# EAGLE design v20 (EAGLE 9.6.1)
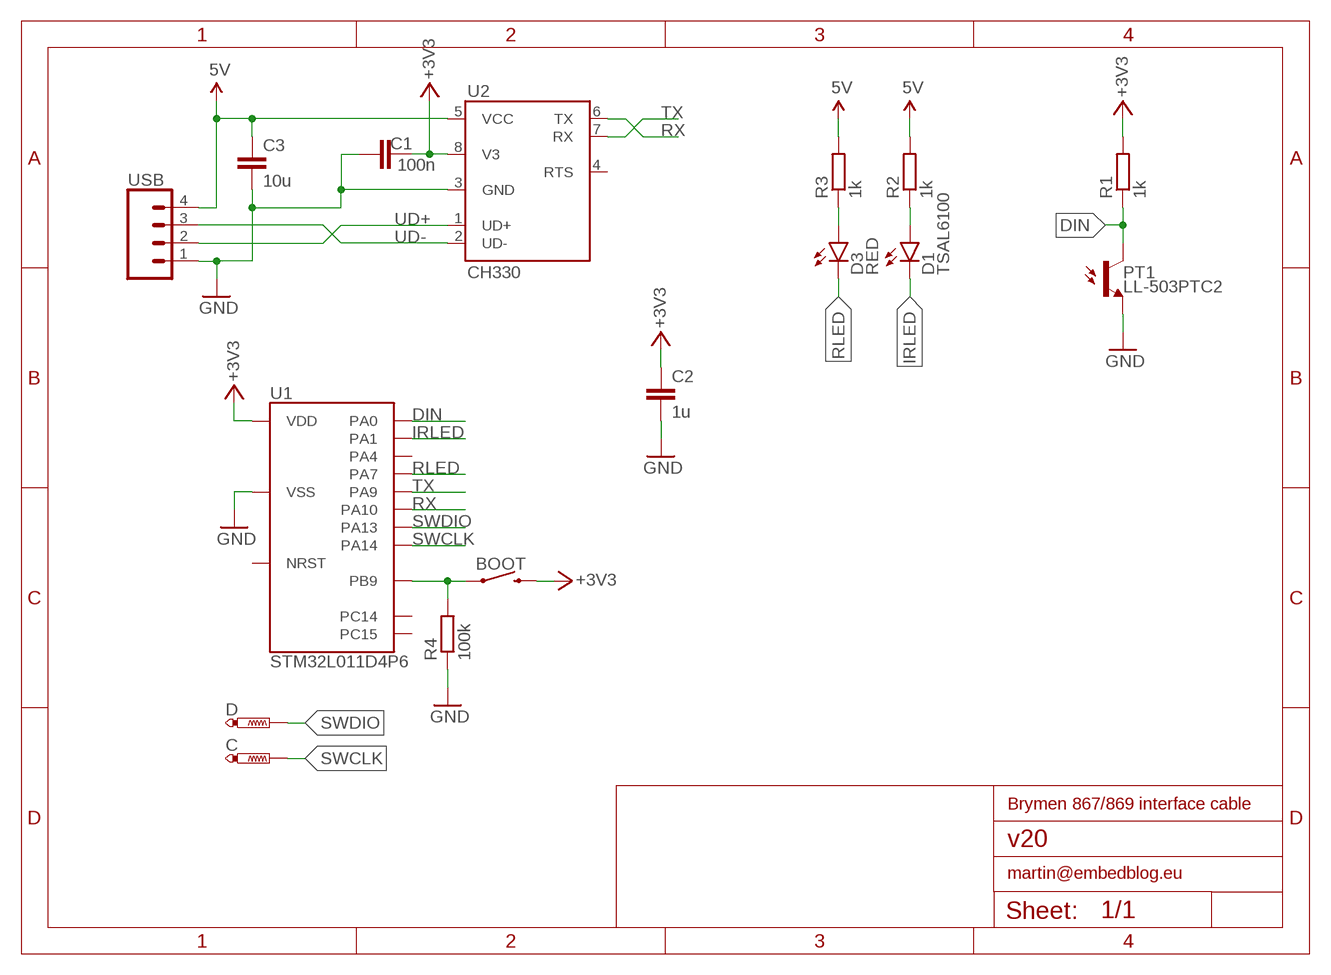
[diagram p0: schematic, sheet 1]

## Parts
BOOT  MOMENTARY-SWITCH-SPST-SMD-5.2MM  [TACTILE_SWITCH_SMD_5.2MM]
C  PTR1B1,27  [B1,27]
C1  100n  C-EUC0805  [C0805]
C2  1u  C-EUC0805  [C0805]
C3  10u  C-EUC0805  [C0805]
D  PTR1B1,27  [B1,27]
D1  TSAL6100  LED5MM  [LED5MM]
D3  RED  LED1206  [LED-1206]
PT1  LL-503PTC2  LL-503_PHOTOTRANSISTOR  [LED5MM]
R1  1k  R-EU_R0805  [R0805]
R2  1k  R-EU_R0805  [R0805]
R3  1k  R-EU_R0805  [R0805]
R4  100k  R-EU_R0805  [R0805]
U1  STM32L011D4P6  [TSSOP14]
U2  CH330  [SO08]
USB  CONN_04  [1X04]

## Nets
5V: C3.1 R2.2 R3.2 U2.5(VCC) USB.4
+3V3: BOOT.3 C1.2 C2.1 R1.2 U1.10(VDD) U2.8(V3)
DIN: PT1.K(C) R1.1 U1.5(PA0)
GND: C1.1 C2.2 C3.2 PT1.A(E) R4.1 U1.9(VSS) U2.3(GND) USB.1
IRLED: D1.K(C) U1.6(PA1)
N$1: BOOT.1 R4.2 U1.1(PB9)
N$3: D1.A R2.1
N$5: D3.A R3.1
RLED: D3.C U1.8(PA7)
RX: U1.12(PA10) U2.6(TX)
SWCLK: C.TP U1.14(PA14)
SWDIO: D.TP U1.13(PA13)
TX: U1.11(PA9) U2.7(RX)
UD+: U2.1(UD+) USB.2
UD-: U2.2(UD-) USB.3
Unconnected: U1.2(PC14) U1.3(PC15) U1.4(NRST) U1.7(PA4) U2.4(RTS)

## Notes on the sheet
- Brymen 867/869 interface cable
- martin@embedblog.eu

## Library data of the parts
BOOT = SparkFun-Switches:MOMENTARY-SWITCH-SPST: Momentary Switch (Pushbutton) - SPST Normally-open (NO) SPST momentary switches (buttons, pushbuttons). Variants PTH-12MM - 12mm square, through-hole Momentary Pushbutton Switch - 12mm Square <https://www.sparkfun.com/products/9190> (COM-09190) PTH-6.0MM, PTH-6.0MM-KIT - 6.0mm square, through-hole Mini Pushbutton Switch <https://www.sparkfun.com/products/97> (COM-00097) KIT package intended for soldering kit's - only one side of pads' copper is exposed. PTH-RIGHT-ANGLE-KIT - Right-angle, through-hole Right Angle Tactile Button <https://www.sparkfun.com/products/10791> - Used on SparkFun BigTime Watch Kit <https://www.sparkfun.com/products/11734> SMD-12MM - 12mm square, surface-mount Tactile Button - SMD (12mm) <https://www.sparkfun.com/products/12993> (COM-12993) Used on SparkFun PicoBoard <https://www.sparkfun.com/products/11888> SMD-4.5MM - 4.5mm Square Trackball Switch Used on SparkFun Blackberry Trackballer Breakout <https://www.sparkfun.com/products/13169> SMD-4.6MMX2.8MM - 4.60mm x 2.80mm, surface mount Used on SparkFun SAMD21 Mini Breakout <https://www.sparkfun.com/products/13664> SMD-5.2MM, SMD-5.2-REDUNDANT - 5.2mm square, surface-mount Mini Pushbutton Switch - SMD <https://www.sparkfun.com/products/8720> (COM-08720) Used on Arduino Pro Mini <https://www.sparkfun.com/products/11114> REDUNDANT package connects both switch circuits together SMD-6.0X3.5MM - 6.0 x 3.5mm, surface mount Momentary Reset Switch SMD <https://www.sparkfun.com/products/8229> (COM-08229) SMD-6.2MM-TALL - 6.2mm square, surface mount Tactile Button - SMD (6mm) <https://www.sparkfun.com/products/12992> Used on SparkFun Digital Sandbox <https://www.sparkfun.com/products/12651> SMD-RIGHT-ANGLE - Right-angle, surface mount Used on SparkFun Block for Intel® Edison - Arduino <https://www.sparkfun.com/products/13036>; PROD_ID: SWCH-08247; SF_SKU: COM-08720
C D = testpad:PTR1: TEST PIN
C1-C3 = resistor:C-EU: CAPACITOR, European symbol
D1 D3 = SparkFun-LED:LED: LEDs Standard schematic elements and footprints for 5mm, 3mm, 1206, and 0603 sized LEDs. 5mm - Spark Fun Electronics SKU : COM-00529 (and others)
PT1 = custom:LL-503_PHOTOTRANSISTOR
R1-R4 = resistor:R-EU_: RESISTOR, European symbol
U1 = custom:STM32L011D4P6
U2 = custom:CH330
USB = SparkFun-Connectors:CONN_04: Multi connection point. Often used as Generic Header-pin footprint for 0.1 inch spaced/style header connections On any of the 0.1 inch spaced packages, you can populate with these: Break Away Headers - Straight <https://www.sparkfun.com/products/116> (PRT-00116) Break Away Male Headers - Right Angle <https://www.sparkfun.com/products/553> (PRT-00553) Female Headers <https://www.sparkfun.com/products/115> (PRT-00115) Break Away Headers - Machine Pin <https://www.sparkfun.com/products/117> (PRT-00117) Break Away Female Headers - Swiss Machine Pin <https://www.sparkfun.com/products/743> (PRT-00743) For SCREWTERMINALS and SPRING TERMINALS visit here: Screw Terimnals on SparkFun.com <https://www.sparkfun.com/search/results?term=Screw+Terminals> (5mm/3.5mm/2.54mm spacing) This device is also useful as a general connection point to wire up your design to another part of your project. Our various solder wires solder well into these plated through hole pads. Hook-Up Wire - Assortment (Stranded, 22 AWG) <https://www.sparkfun.com/products/11375> (PRT-11375) Hook-Up Wire - Assortment (Solid Core, 22 AWG) <https://www.sparkfun.com/products/11367> (PRT-11367) View the entire wire category on our website here <https://www.sparkfun.com/categories/141> Special notes: Molex polarized connector foot print use with SKU : PRT-08231 with associated crimp pins and housings. 1MM SMD Version SKU: PRT-10208; PROD_ID: CONN-09696

## Board
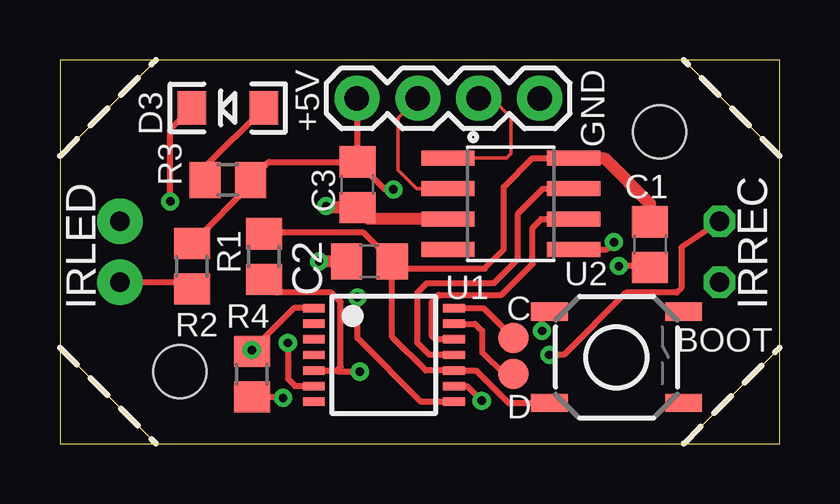
[diagram p1: board, top side]
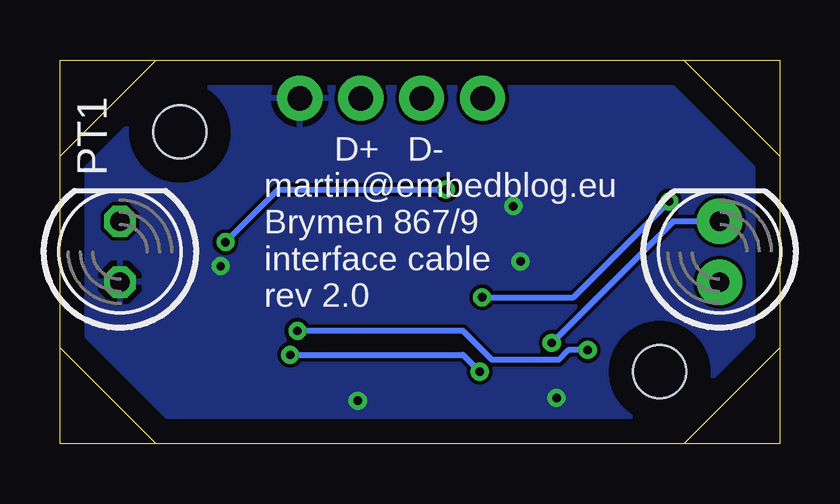
[diagram p2: board, bottom side, seen from below]

Size 30 x 16 mm. Coordinates in mm from the lower left corner, seen from the top.
Outline: 0,12 4,16
Outline: 0,4 4,0
Outline: 30,12 26,16
Outline: 26,0 30,4
Outline: 0,0 30,0 30,16 0,16 0,0
Copper layers (1*16): Top 0.035mm / dielectric 1.5mm / Bottom 0.035mm
Design rules "default": minimum track width 6mil, minimum drill 0.35mm, track to track 6mil, track to pad 6mil, pad to pad 6mil, via to via 6mil, smd to smd 6mil, copper to edge 40mil, drill to drill 6mil, minimum pad ring 10mil, minimum via ring 8mil, stop-mask expansion 4mil, vias tented up to drill 0mil, thermal gap 10mil
Holes 2.2 mm at 5,3 25,13

### Footprints (pad centres in the part's own frame; a part is rotated, then mirrored left to right if it is on the bottom)
TACTILE_SWITCH_SMD_5.2MM = smd 1.524 x 0.762: 1 -2.794,1.905; 2 2.794,1.905; 3 -2.794,-1.905; 4 2.794,-1.905
B1,27 = smd 1.27 x 1.27: TP 0,0
C0805 = smd 1.3 x 1.5: 1 -0.95,0; 2 0.95,0
LED5MM = drill 0.813 pad 1.88: A -1.27,0; K 1.27,0
LED-1206 = smd 1.2 x 1.4: A -1.5,0; C 1.5,0
LED5MM' = drill 0.813 octagon: A -1.27,0; K 1.27,0
R0805 = smd 1.3 x 1.5: 1 -0.95,0; 2 0.95,0
TSSOP14 = smd 0.35 x 0.9: 1 -1.95,-2.925; 2 -1.3,-2.925; 3 -0.65,-2.925; 4 0,-2.925; 5 0.65,-2.925; 6 1.3,-2.925; 7 1.95,-2.925; 8 1.95,2.925; 9 1.3,2.925; 10 0.65,2.925; 11 0,2.925; 12 -0.65,2.925; 13 -1.3,2.925; 14 -1.95,2.925
SO08 = smd 0.61 x 2.21: 1 -1.905,-2.616; 2 -0.635,-2.616; 3 0.635,-2.616; 4 1.905,-2.616; 5 1.905,2.616; 6 0.635,2.616; 7 -0.635,2.616; 8 -1.905,2.616
1X04 = drill 1.016 pad 1.88: 1 0,0; 2 2.54,0; 3 5.08,0; 4 7.62,0

### Placement (x,y rotation side)
BOOT  23.2,3.6 0 top
C  18.9,4.4 0 top
C1  24.6,8.3 90 top
C2  12.9,7.6 180 top
C3  12.4,10.8 270 top
D  18.9,2.9 0 top
D1  2.5,8 90 bottom
D3  7,14 180 top
PT1  LL-503PTC2  [LED5MM']  27.5,8 90 bottom
R1  8.5,7.8 90 top
R2  5.5,7.4 90 top
R3  7,11 0 top
R4  8,2.9 90 top
U1  13.5,3.7 270 top
U2  18.8,10 270 top
USB  20,14.4 180 top

### Tracks (layer width: path | path; a pad name or v marks a point on that pad's centre or on a via)
5V  (via drill 0.35)
  Top 0.254: USB.4 12.38,11.77 C3.1 | R3.2 8.07,11.12 | 8.07,11.12 8.7,11.75 C3.1 | R2.2 8.07,10.93 8.07,11.12 | U2.5 22.8,8.1 v23.1,8.4 | v13.9,10.6 13.55,10.6 C3.1
  Bottom 0.254: v23.1,8.4 20.9,10.6 v13.9,10.6
+3V3
  Top 0.254: C2.1 13.85,4.45 15.25,3.05 U1.10 17.35,3.05 18.7,1.7 BOOT.3 | C2.1 14.15,7.3 17.7,7.3 18.5,8.1 18.5,10.7 19.7,11.9 22,11.9 | C2.1 12.65,8.8 8.55,8.8 R1.2
  Top 0.508: U2.8 22,11.9 22.7,11.9 24.6,10 C1.2
DIN  (via drill 0.35)
  Top 0.254: U1.5 11.55,3.05 | 11.55,3.05 11.7,3.2 11.7,5.9 11.3,6.3 9.05,6.3 R1.1 | v20.4,3.7 21,3.7 23.6,6.3 25.7,6.3 25.9,6.5 25.9,8.17 PT1.K | v12.5,3 11.6,3 11.55,3.05
  Bottom 0.254: v20.4,3.7 13.2,3.7 v12.5,3
GND  (via drill 0.35)
  Top 0.254: R4.1 9.25,1.95 v9.3,1.9 | U1.9 16.97,2.4 v17.59,1.78 | C1.1 24.55,7.4 v23.3,7.4
  Top 0.508: U2.3 12.88,9.37 C3.2 11.15,9.85 v11.1,9.9 | C2.2 v10.8,7.6
  pour Bottom: 0,16 30,16 30,0 0,0
IRLED  (via drill 0.35)
  Top 0.254: v9.5,4.2 9.5,2.7 9.8,2.4 U1.6
  Bottom 0.254: D1.K 4.43,9.27 v9.5,4.2
N$1  (via drill 0.35)
  Top 0.254: U1.1 9.75,5.65 v8,3.9 | v20.1,4.7 20.1,5.2 BOOT.1
  Top 0.508: R4.2 v8,3.9
  Bottom 0.254: v8,3.9 8.8,3.9 9.2,3.5 12,3.5 13.2,4.7 v20.1,4.7
N$3
  Top 0.254: D1.A 5.22,6.73 R2.1
N$5
  Top 0.254: R3.1 6.05,11.55 D3.A
RLED  (via drill 0.35)
  Top 0.254: U1.8 15.05,1.75 12.4,4.4 v12.4,6.1 | v4.6,10.1 4.6,13.1 D3.C
  Bottom 0.254: v12.4,6.1 8.6,6.1 v4.6,10.1
RX
  Top 0.254: U1.12 15.65,4.35 15.5,4.5 15.5,5.9 15.8,6.2 18.4,6.2 19.7,7.5 19.7,9 20.07,9.37 U2.6
SWCLK
  Top 0.254: U1.14 17.65,5.65 C.TP
SWDIO
  Top 0.254: U1.13 17.3,5 17.6,4.7 17.6,3.8 18.5,2.9 D.TP
TX
  Top 0.254: U1.11 15.4,3.7 14.9,4.2 14.9,6.29 15.3,6.69 18.09,6.69 19.1,7.7 19.1,9.6 20.14,10.63 U2.7
UD+
  Top 0.152: U2.1 18.61,11.9 18.8,12.1 18.8,13.6 18,14.4 USB.2
UD-
  Top 0.152: USB.3 14.1,13.58 14.1,11.4 14.87,10.63 U2.2

### Text on the board
tNames: +5V | GND | IRLED | IRREC
bNames: D- | D+ | martin@embedblog.eu / Brymen 867/9 / interface cable / rev 2.0